# Altium schematic sheet 01 REVISION HISTORY.SchDoc
size 420 x 297 mm
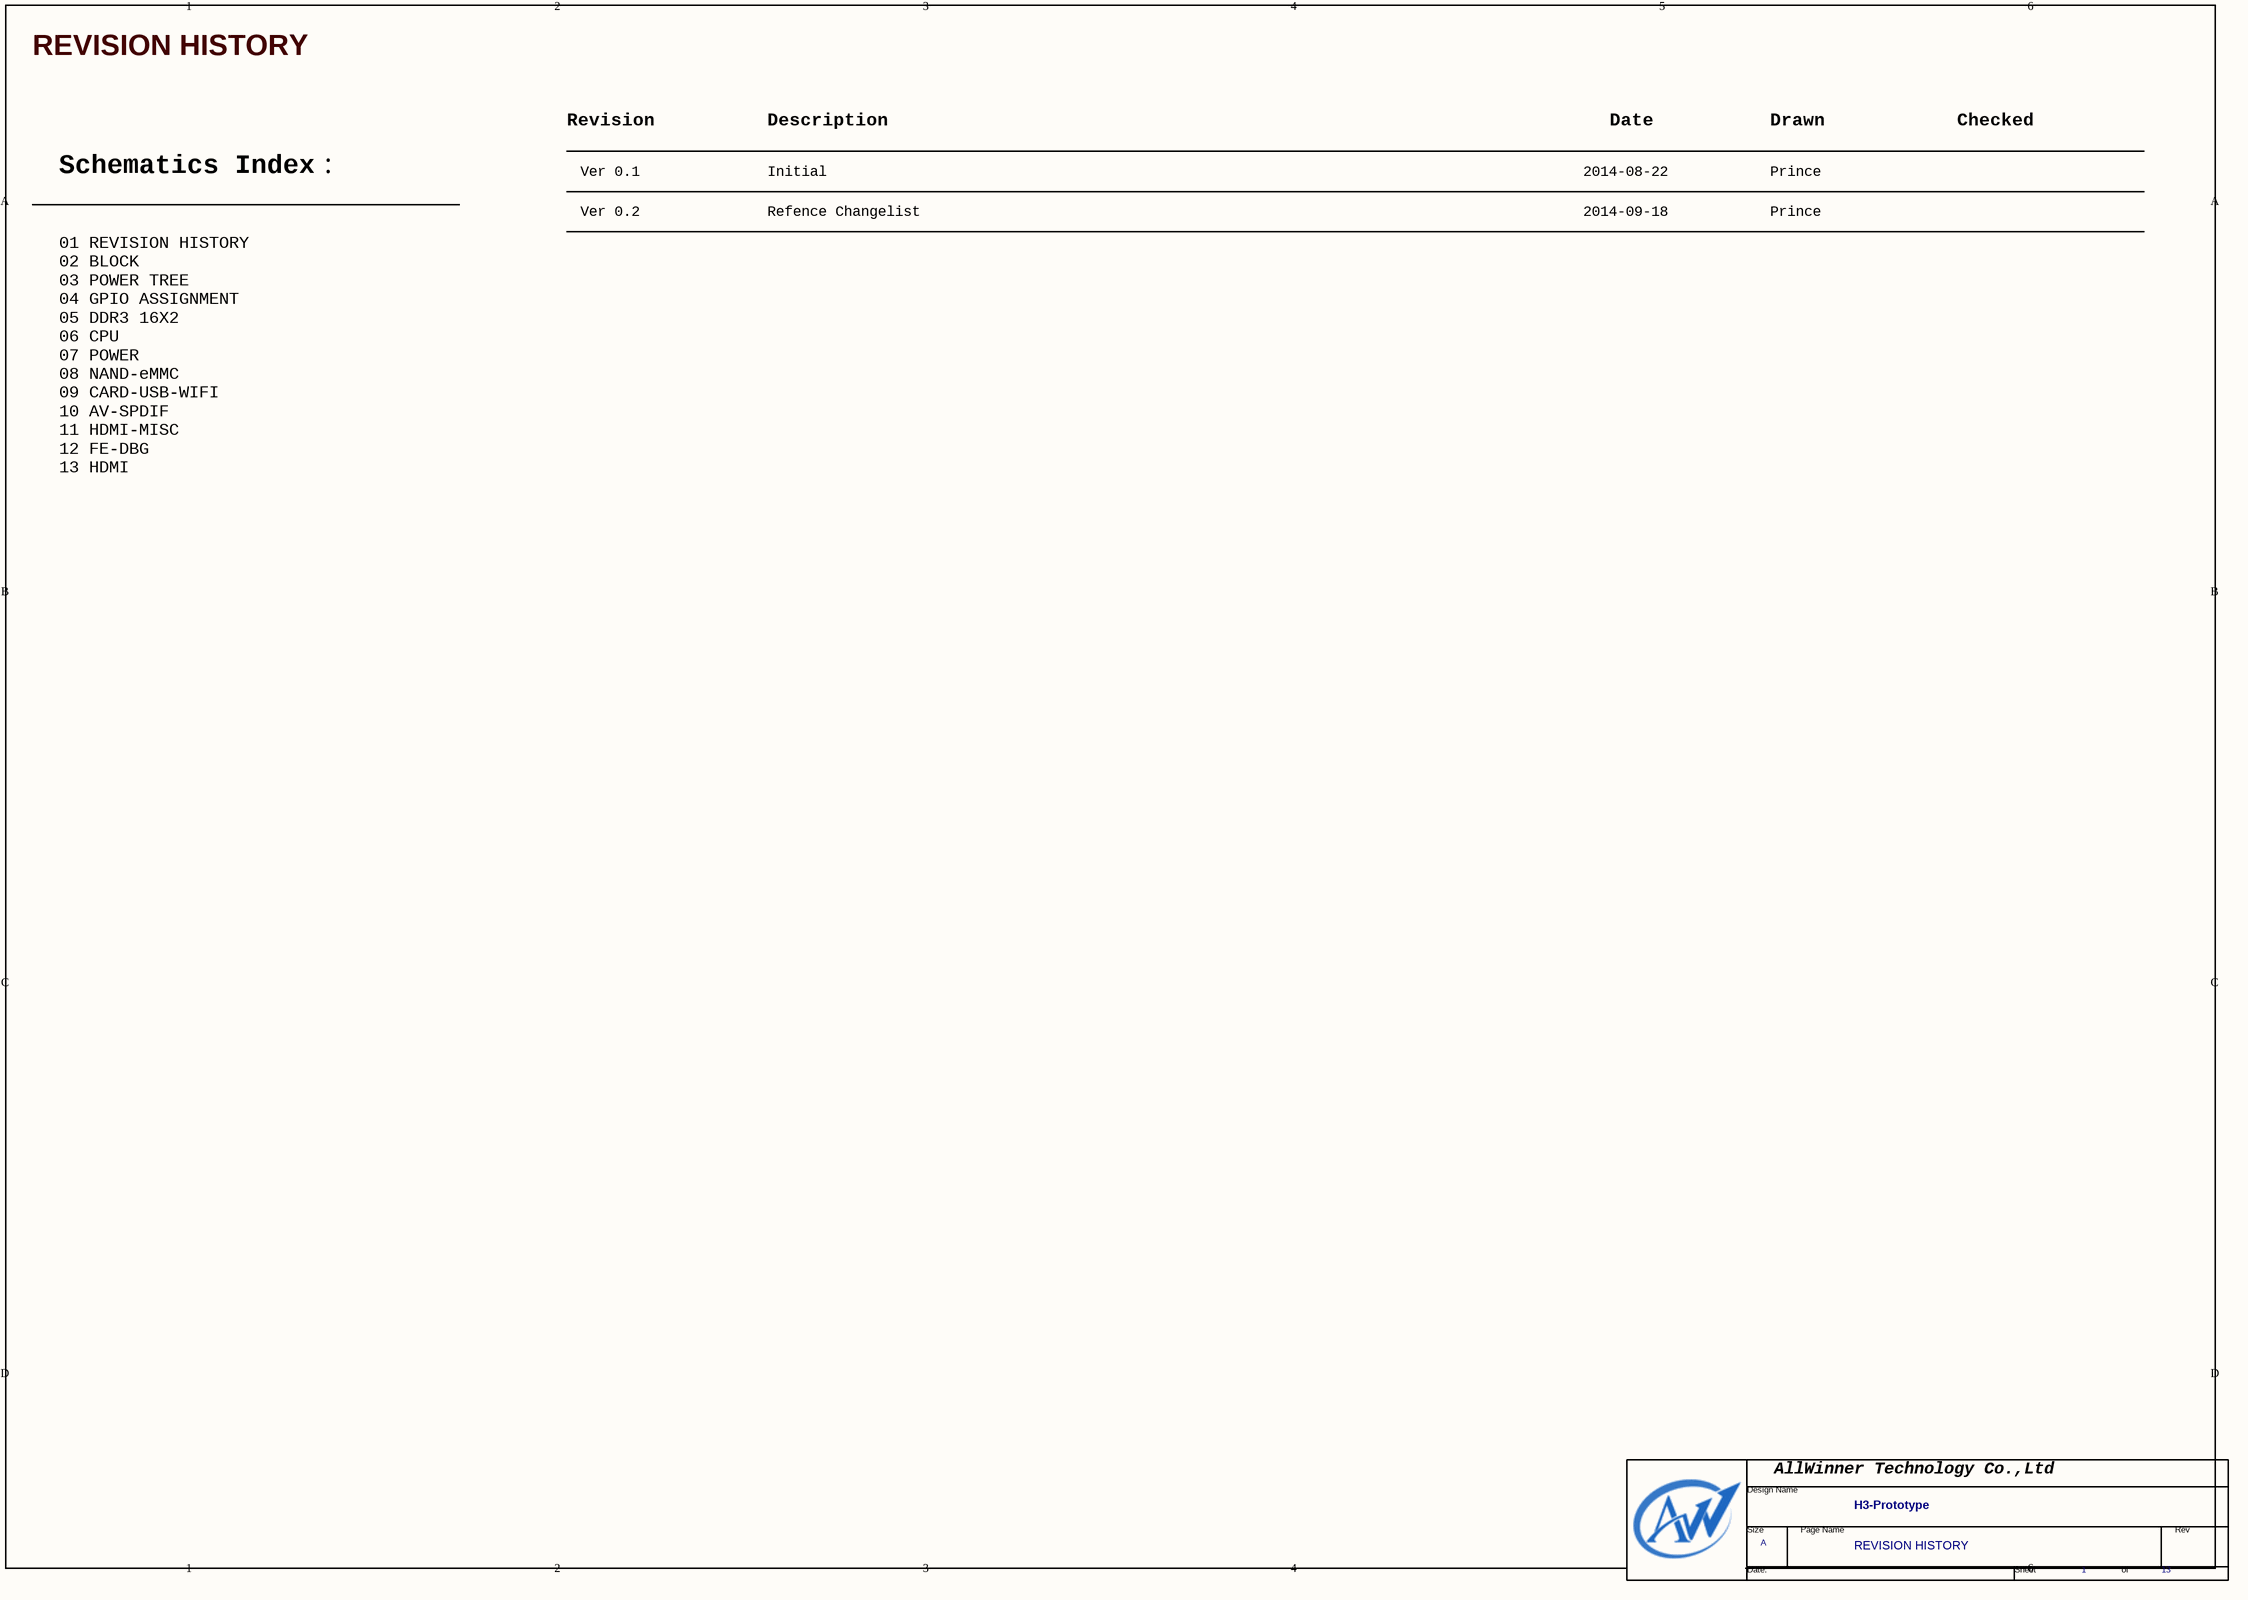
[diagram p0: 01 REVISION HISTORY.SchDoc]

## Parts
*  Page Count: 13  Page Number: 1  Page Size: A  Title: H3-Prototype  Doc: REVISION HISTORY  (hidden comment: TitleBlock0-AW)  (graphical)

## Notes on the sheet
- REVISION HISTORY
- Revision
- Description
- Date
- Drawn
- Checked
- Schematics Index：
- Ver 0.1
- Initial
- 2014-08-22
- Prince
- 01 REVISION HISTORY
  02 BLOCK
  03 POWER TREE
  04 GPIO ASSIGNMENT
  05 DDR3 16X2
  06 CPU
  07 POWER
  08 NAND-eMMC
  09 CARD-USB-WIFI
  10 AV-SPDIF
  11 HDMI-MISC
  12 FE-DBG
  13 HDMI
- Ver 0.2
- Refence Changelist
- 2014-09-18
- (in symbol TitleBlock0-AW) AllWinner Technology Co.,Ltd; Design Name; Size; Page Name; Rev; Date:; Sheet; of

## Library data of the parts
* = TitleBlock0-AW: RevCode: 0.1; Page Create Date: March  8, 1995